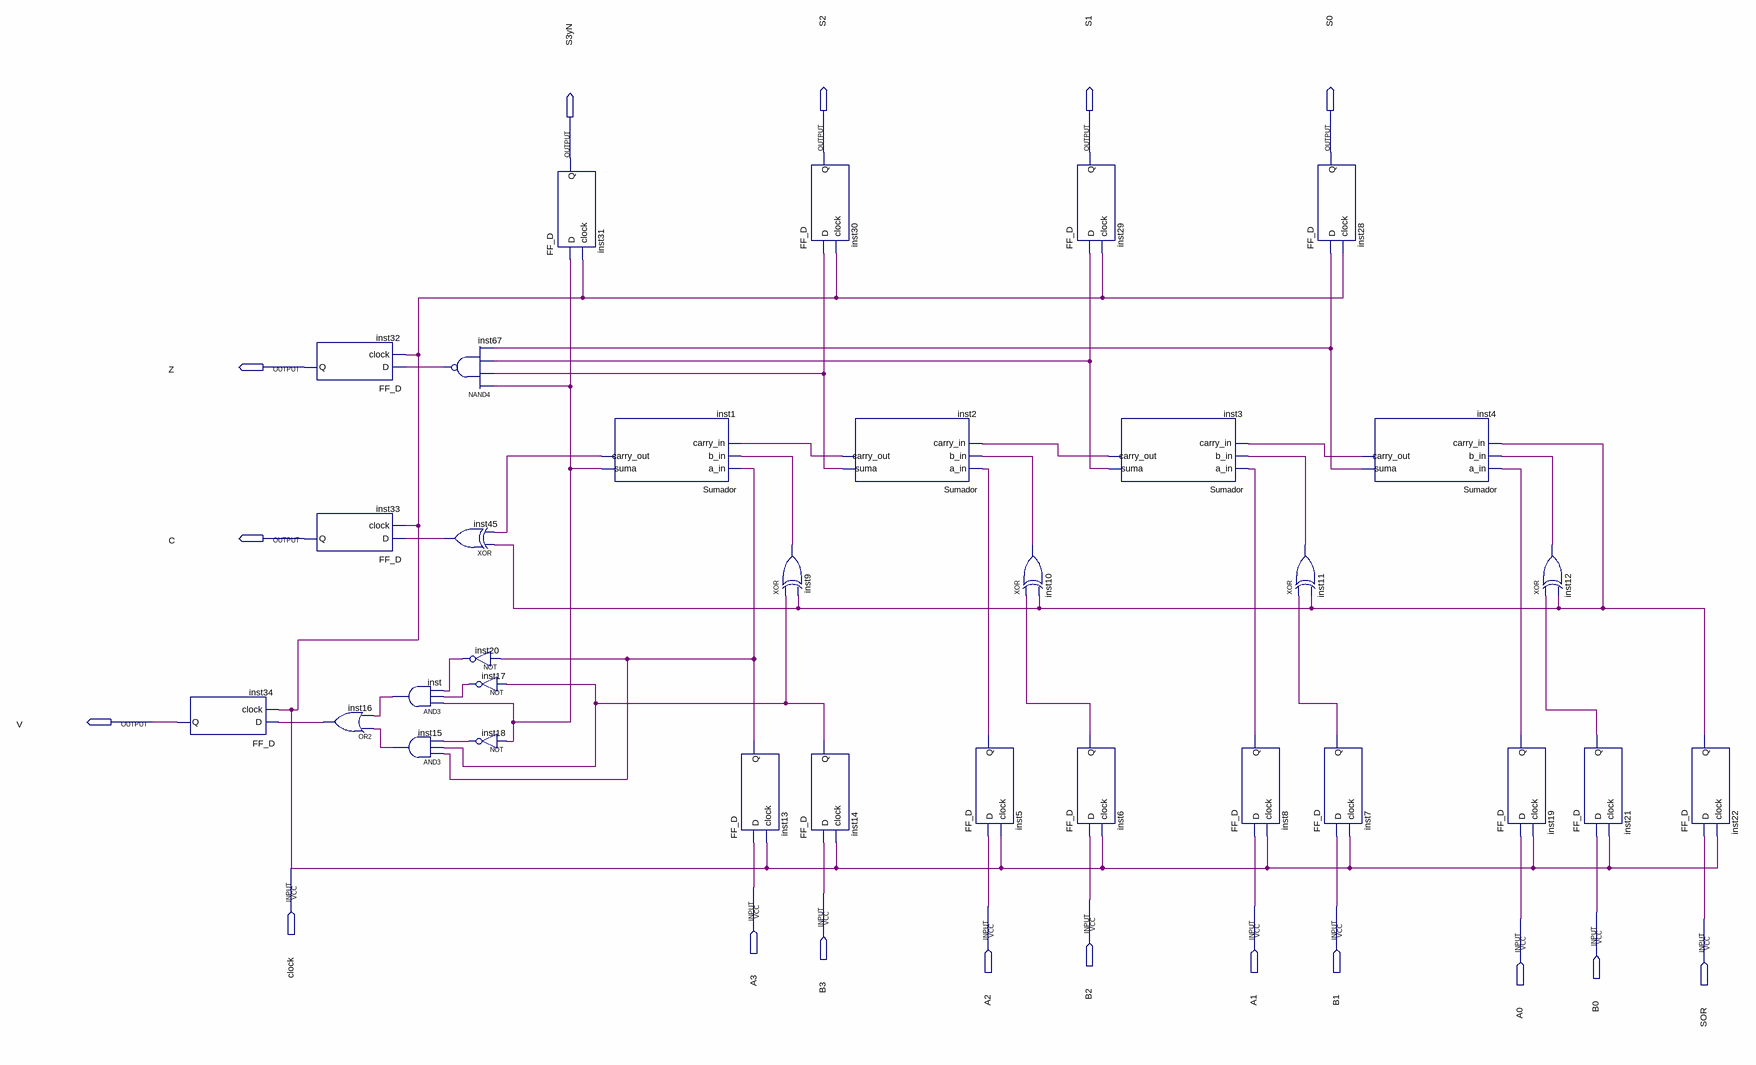
[diagram p0: schematic sheet]
// Quartus schematic Block1.bdf as structural Verilog: 32 symbols, 17 pins
module Block1 (
  input  clock,
  input  A3,
  input  B3,
  input  B2,
  input  A2,
  input  A1,
  input  B1,
  input  B0,
  input  A0,
  input  SOR,
  output S2,
  output S1,
  output S0,
  output S3yN,
  output Z,
  output C,
  output V
);

  wire inst1_carry_out, inst1_suma, inst2_carry_out, inst2_suma, inst3_carry_out, inst3_suma,
       inst4_carry_out, inst4_suma, inst5_q, inst6_q, inst7_q, inst8_q, inst9_out, inst10_out, inst11_out,
       inst12_out, inst13_q, inst14_q, inst15_out, inst16_out, inst17_out, inst18_out, inst19_q, inst20_out,
       inst21_q, inst22_q, inst45_out, inst67_out, inst_out;

  FF_D inst34 (.D(inst16_out), .clock(clock), .Q(V));
  FF_D inst32 (.D(inst67_out), .clock(clock), .Q(Z));
  FF_D inst33 (.D(inst45_out), .clock(clock), .Q(C));
  or inst16 (inst16_out, inst15_out, inst_out);
  and inst (inst_out, inst1_suma, inst17_out, inst20_out);
  and inst15 (inst15_out, inst13_q, inst14_q, inst18_out);
  nand inst67 (inst67_out, inst1_suma, inst2_suma, inst3_suma, inst4_suma);
  xor inst45 (inst45_out, inst22_q, inst1_carry_out);
  not inst20 (inst20_out, inst13_q);
  not inst17 (inst17_out, inst14_q);
  not inst18 (inst18_out, inst1_suma);
  FF_D inst31 (.D(inst1_suma), .clock(clock), .Q(S3yN));
  Sumador inst1 (
    .a_in(inst13_q), .b_in(inst9_out), .carry_in(inst2_carry_out), .suma(inst1_suma),
    .carry_out(inst1_carry_out));
  FF_D inst13 (.D(A3), .clock(clock), .Q(inst13_q));
  FF_D inst30 (.D(inst2_suma), .clock(clock), .Q(S2));
  xor inst9 (inst9_out, inst14_q, inst22_q);
  FF_D inst14 (.D(B3), .clock(clock), .Q(inst14_q));
  Sumador inst2 (
    .a_in(inst5_q), .b_in(inst10_out), .carry_in(inst3_carry_out), .suma(inst2_suma),
    .carry_out(inst2_carry_out));
  FF_D inst5 (.D(A2), .clock(clock), .Q(inst5_q));
  xor inst10 (inst10_out, inst6_q, inst22_q);
  FF_D inst29 (.D(inst3_suma), .clock(clock), .Q(S1));
  Sumador inst3 (
    .a_in(inst8_q), .b_in(inst11_out), .carry_in(inst4_carry_out), .suma(inst3_suma),
    .carry_out(inst3_carry_out));
  FF_D inst6 (.D(B2), .clock(clock), .Q(inst6_q));
  FF_D inst8 (.D(A1), .clock(clock), .Q(inst8_q));
  FF_D inst28 (.D(inst4_suma), .clock(clock), .Q(S0));
  xor inst11 (inst11_out, inst7_q, inst22_q);
  FF_D inst7 (.D(B1), .clock(clock), .Q(inst7_q));
  Sumador inst4 (
    .a_in(inst19_q), .b_in(inst12_out), .carry_in(inst22_q), .suma(inst4_suma), .carry_out(inst4_carry_out));
  FF_D inst19 (.D(A0), .clock(clock), .Q(inst19_q));
  xor inst12 (inst12_out, inst21_q, inst22_q);
  FF_D inst21 (.D(B0), .clock(clock), .Q(inst21_q));
  FF_D inst22 (.D(SOR), .clock(clock), .Q(inst22_q));
endmodule
